# EAGLE design Sound Activation 2019-2 (EAGLE 9.3.1)
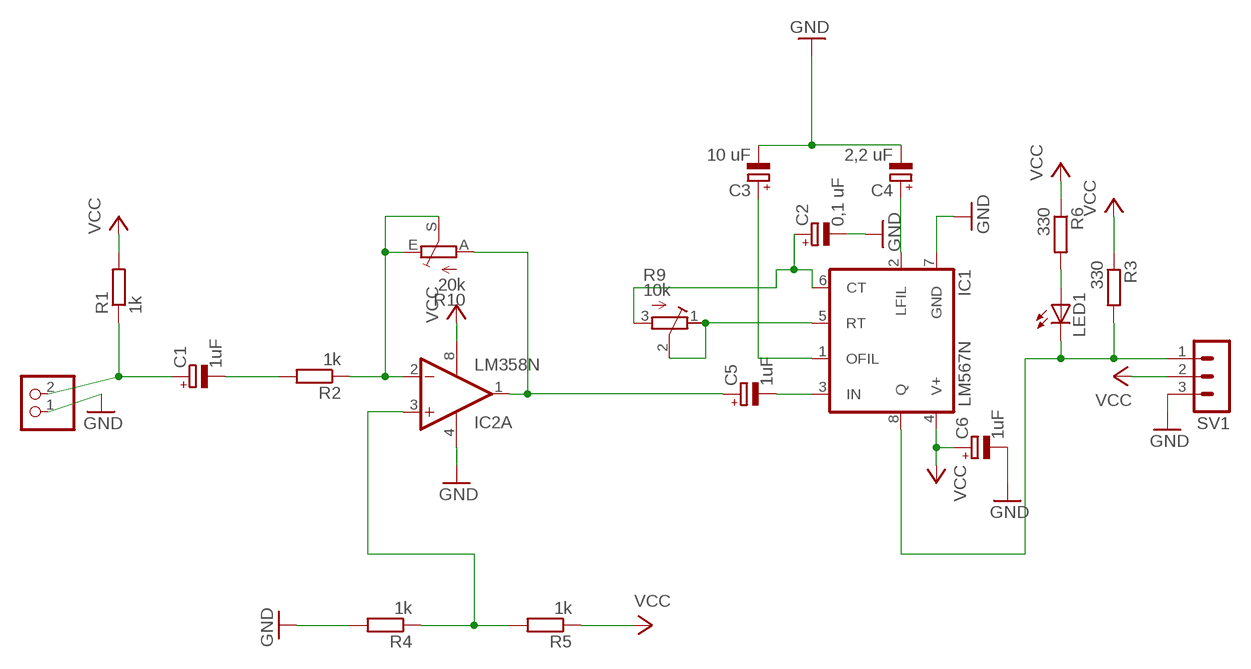
[diagram p0: schematic, sheet 1]

## Parts
C1  1uF  CPOL-EUE1.8-4  [E1,8-4]
C2  0,1 uF  CPOL-EUE1.8-4  [E1,8-4]
C3  10 uF  CPOL-EUE1.8-4  [E1,8-4]
C4  2,2 uF  CPOL-EUE1.8-4  [E1,8-4]
C5  1uF  CPOL-EUE1.8-4  [E1,8-4]
C6  1uF  CPOL-EUE1.8-4  [E1,8-4]
IC1  LM567N  [DIL08]
IC2  LM358N  [DIL08]
LED1  LED3MM  [LED3MM]
M1  PINHD-1X2  [1X02]
R1  1k  R-EU_0204/7  [0204/7]
R2  1k  R-EU_0204/7  [0204/7]
R3  330  R-EU_0204/7  [0204/7]
R4  1k  R-EU_0204/7  [0204/7]
R5  1k  R-EU_0204/7  [0204/7]
R6  330  R-EU_0204/7  [0204/7]
R9  10k  R-TRIMM3006P  [RTRIM3006P]
R10  20k  TRIM_EU-B25P  [B25P]
SV1  MA03-1  [MA03-1]

## Nets
GND: C2.- C3.- C4.- C6.- IC1.7(GND) IC2.4(P:V-) M1.1 R4.2 SV1.3
N$1: IC2.2(A:-IN) R2.1 R10.E R10.S
N$2: IC2.3(A:+IN) R4.1 R5.2
N$3: C1.+ M1.2 R1.1
N$4: C1.- R2.2
N$5: C2.+ IC1.6(CT) R9.3(A)
N$6: IC1.5(RT) R9.1(E) R9.2(S)
N$7: C5.+ IC2.1(A:OUT) R10.A
N$8: IC1.8(Q) LED1.K(C) R3.2 SV1.1
N$9: LED1.A R6.2
N$10: C5.- IC1.3(IN)
N$12: C3.+ IC1.1(OFIL)
N$13: C4.+ IC1.2(LFIL)
VCC: C6.+ IC1.4(V+) IC2.8(P:V+) R1.2 R3.1 R5.1 R6.1 SV1.2
Unconnected: IC2.5(B:+IN) IC2.6(B:-IN) IC2.7(B:OUT)

## Library data of the parts
C1-C6 = rcl:CPOL-EU: POLARIZED CAPACITOR, European symbol
IC1 = linear:*567: TONE DECODER
IC2 = linear:LM358: OP AMP also LM158; LM258; LM2904 Source: http://cache.national.com/ds/LM/LM158.pdf
LED1 = led:LED: LED OSRAM: - CHIPLED LG R971, LG N971, LY N971, LG Q971, LY Q971, LO R971, LY R971 LH N974, LH R974 LS Q976, LO Q976, LY Q976 LO Q996 - Hyper CHIPLED LW Q18S LB Q993, LB Q99A, LB R99A - SideLED LS A670, LO A670, LY A670, LG A670, LP A670 LB A673, LV A673, LT A673, LW A673 LH A674 LY A675 LS A676, LA A676, LO A676, LY A676, LW A676 LS A679, LY A679, LG A679 - Hyper Micro SIDELED® LS Y876, LA Y876, LO Y876, LY Y876 LT Y87S - SmartLED LW L88C, LW L88S LB L89C, LB L89S, LG L890 LS L89K, LO L89K, LY L89K LS L896, LA L896, LO L896, LY L896 - TOPLED LS T670, LO T670, LY T670, LG T670, LP T670 LSG T670, LSP T670, LSY T670, LOP T670, LYG T670 LG T671, LOG T671, LSG T671 LB T673, LV T673, LT T673, LW T673 LH T674 LS T676, LA T676, LO T676, LY T676, LB T676, LH T676, LSB T676, LW T676 LB T67C, LV T67C, LT T67C, LS T67K, LO T67K, LY T67K, LW E67C LS E67B, LA E67B, LO E67B, LY E67B, LB E67C, LV E67C, LT E67C LW T67C LS T679, LY T679, LG T679 LS T770, LO T770, LY T770, LG T770, LP T770 LB T773, LV T773, LT T773, LW T773 LH T774 LS E675, LA E675, LY E675, LS T675 LS T776, LA T776, LO T776, LY T776, LB T776 LHGB T686 LT T68C, LB T68C - Hyper Mini TOPLED® LB M676 - Mini TOPLED Santana® LG M470 LS M47K, LO M47K, LY M47K Source: http://www.osram.convergy.de LUXEON: - LUMILED® LXK2-PW12-R00, LXK2-PW12-S00, LXK2-PW14-U00, LXK2-PW14-V00 LXK2-PM12-R00, LXK2-PM12-S00, LXK2-PM14-U00 LXK2-PE12-Q00, LXK2-PE12-R00, LXK2-PE12-S00, LXK2-PE14-T00, LXK2-PE14-U00 LXK2-PB12-K00, LXK2-PB12-L00, LXK2-PB12-M00, LXK2-PB14-N00, LXK2-PB14-P00, LXK2-PB14-Q00 LXK2-PR12-L00, LXK2-PR12-M00, LXK2-PR14-Q00, LXK2-PR14-R00 LXK2-PD12-Q00, LXK2-PD12-R00, LXK2-PD12-S00 LXK2-PH12-R00, LXK2-PH12-S00 LXK2-PL12-P00, LXK2-PL12-Q00, LXK2-PL12-R00 Source: www.luxeon.com KINGBRIGHT: KA-3528ASYC Source: www.kingbright.com
M1 = pinhead:PINHD-1X2: PIN HEADER
R1-R6 = rcl:R-EU_: RESISTOR, European symbol
R9 = rcl:R-TRIMM: Trimm resistor
R10 = pot:TRIM_EU-: POTENTIOMETER
SV1 = con-lstb:MA03-1: PIN HEADER; OC_FARNELL: unknown; OC_NEWARK: unknown

## Board
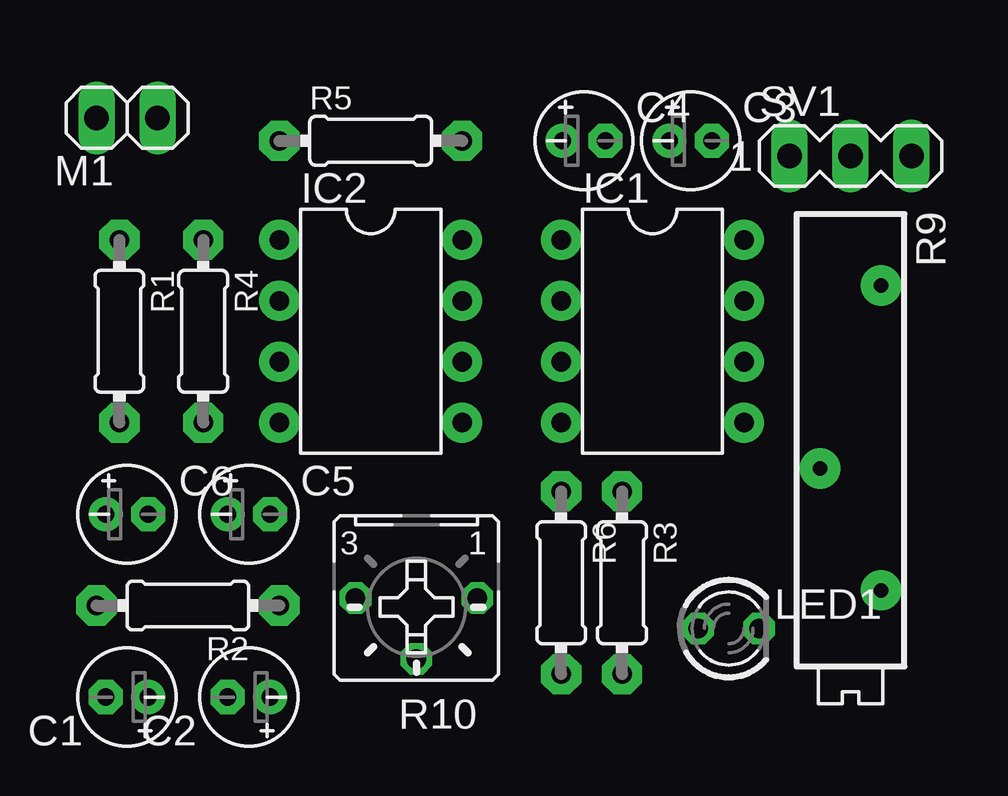
[diagram p1: board, top side]
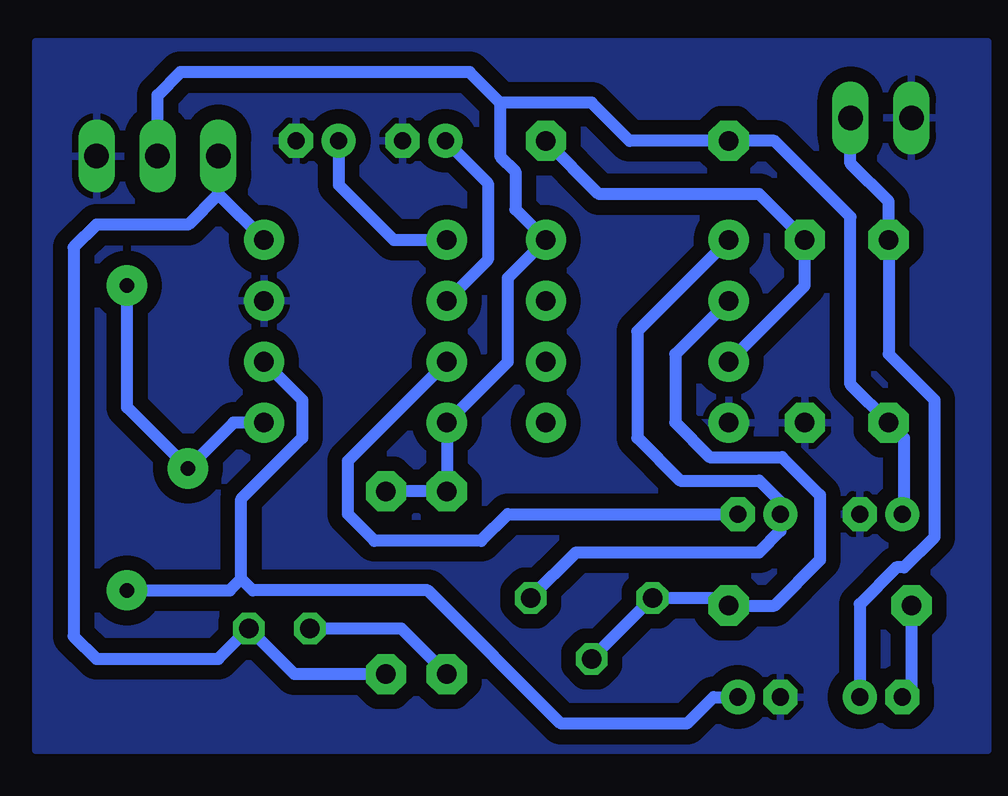
[diagram p2: board, bottom side, seen from below]

No outline drawn. Coordinates in mm, seen from the top.
Copper layers (1*16): Top 0.035mm / dielectric 1.5mm / Bottom 0.035mm
Design rules "default *": minimum track width 6mil, minimum drill 0.35mm, track to track 6mil, track to pad 6mil, pad to pad 6mil, via to via 6mil, smd to smd 6mil, copper to edge 40mil, drill to drill 6mil, minimum pad ring 10mil, minimum via ring 8mil, stop-mask expansion 4mil, vias tented up to drill 0mil, thermal gap 10mil

### Footprints (pad centres in the part's own frame; a part is rotated, then mirrored left to right if it is on the bottom)
E1,8-4 = drill 0.711 pad 1.422: + -0.889,0 | drill 0.711 pad 1.422 octagon: - 0.889,0
DIL08 = drill 0.813 pad 1.676: 1 -3.81,-3.81; 2 -1.27,-3.81; 3 1.27,-3.81; 4 3.81,-3.81; 5 3.81,3.81; 6 1.27,3.81; 7 -1.27,3.81; 8 -3.81,3.81
LED3MM = drill 0.813 octagon: A -1.27,0; K 1.27,0
1X02 = drill 1.016 long: 1 -1.27,0; 2 1.27,0
0204/7 = drill 0.813 pad 1.676 octagon: 1 -3.81,0; 2 3.81,0
RTRIM3006P = drill 0.61 pad 1.676: 1 -7.62,1.27; 2 0,-1.27; 3 5.08,1.27
B25P = drill 0.813 octagon: A -2.54,0; E 2.54,0; S 0,2.54
MA03-1 = drill 1.016 long: 1 -2.54,0; 2 0,0; 3 2.54,0

### Placement (x,y rotation side)
C1  20.95,13.34 180 top
C2  26.04,13.34 180 top
C3  44.45,36.51 0 top
C4  40.01,36.51 0 top
C5  26.04,20.95 0 top
C6  20.95,20.95 0 top
IC1  42.86,28.57 270 top
IC2  31.11,28.57 270 top
LED1  46.04,16.19 0 top
M1  20.95,37.47 0 top
R1  20.64,28.57 270 top
R2  23.5,17.14 180 top
R3  41.59,18.1 270 top
R4  24.13,28.57 270 top
R5  31.11,36.51 0 top
R6  39.05,18.1 270 top
R9  51.12,22.86 270 top
R10  33.02,17.46 180 top
SV1  51.12,35.88 0 top

### Tracks (layer width: path | path; a pad name or v marks a point on that pad's centre or on a via)
GND
  Bottom 0.508: 45.34,36.89 C3.-
  pour Bottom (isolate 0.61): 16.51,40.64 56.2,40.64 56.2,11.11 16.51,11.11
N$1
  Bottom 0.508: R10.S R10.E 27.62,17.46 R2.1 25.4,17.14 23.5,19.05 23.5,21.75 25.08,23.34 28.1,23.34 29.53,24.77 29.53,27.62 IC2.2
N$2
  Bottom 0.508: IC2.3 24.13,30.48 R4.1 26.04,34.29 32.7,34.29 R5.2
N$3
  Bottom 0.508: C1.+ 21.84,17.21 20.32,18.73 20,18.73 18.73,20 18.73,25.72 20.64,27.62 R1.1 20.64,33.97 22.23,35.56 M1.2
N$4
  Bottom 0.508: R2.2 19.68,13.72 C1.-
N$5
  Bottom 0.508: IC1.6 45.09,25.72 45.09,24.13 47.62,21.59 47.62,18.26 | C2.+ 27.94,13.34 29.05,12.22 34.29,12.22 39.85,17.78 47.15,17.78 47.62,18.26 | R9.3 48.1,17.78 47.62,18.26
N$6
  Bottom 0.508: IC1.5 47.94,24.77 R9.2 52.39,25.4 R9.1
N$7
  Bottom 0.508: R10.A 33.66,19.37 26.04,19.37 25.15,20.26 C5.+ 25.15,21.46 26.04,22.35 29.34,22.35 31.11,24.13 31.11,28.57 IC2.1
N$8
  Bottom 0.508: IC1.8 48.58,34.29 | 48.58,34.29 SV1.1 | 48.58,34.29 49.85,33.02 53.66,33.02 54.61,32.07 54.61,15.88 53.66,14.92 48.58,14.92 LED1.K 45.4,14.29 R3.2
N$9
  Bottom 0.508: LED1.A 40.96,16.19 R6.2
N$10
  Bottom 0.508: C5.- 36.51,20.95 37.62,19.84 42.07,19.84 43.18,20.95 43.18,23.18 IC1.3
N$12
  Bottom 0.508: C3.+ 43.56,34.67 41.27,32.38 IC1.1
N$13
  Bottom 0.508: C4.+ 37.34,34.73 37.34,31.56 IC1.2
VCC
  Bottom 0.508: SV1.2 51.12,38.42 50.16,39.37 38.1,39.37 36.83,38.1 | 36.83,38.1 33.02,38.1 31.43,36.51 R5.1 25.4,36.51 22.23,33.34 22.23,26.35 R1.2 20,24.13 20,21.02 C6.+ | 36.83,38.1 36.83,35.88 36.2,35.24 36.2,33.66 IC2.8 36.51,30.8 36.51,27.3 IC1.4 R6.1 R3.1